# Altium schematic sheet ASCII_12_USB3_0_device.SchDoc: USB3.0 device
size A3; Organization: Lime Microsystems; Address1: Surrey Tech Centre; Address2: Guildford GU2 7YG; Address3: Surray; Address4: United Kingdom; Revision: v1.4s; SheetNumber: 12; SheetTotal: 15
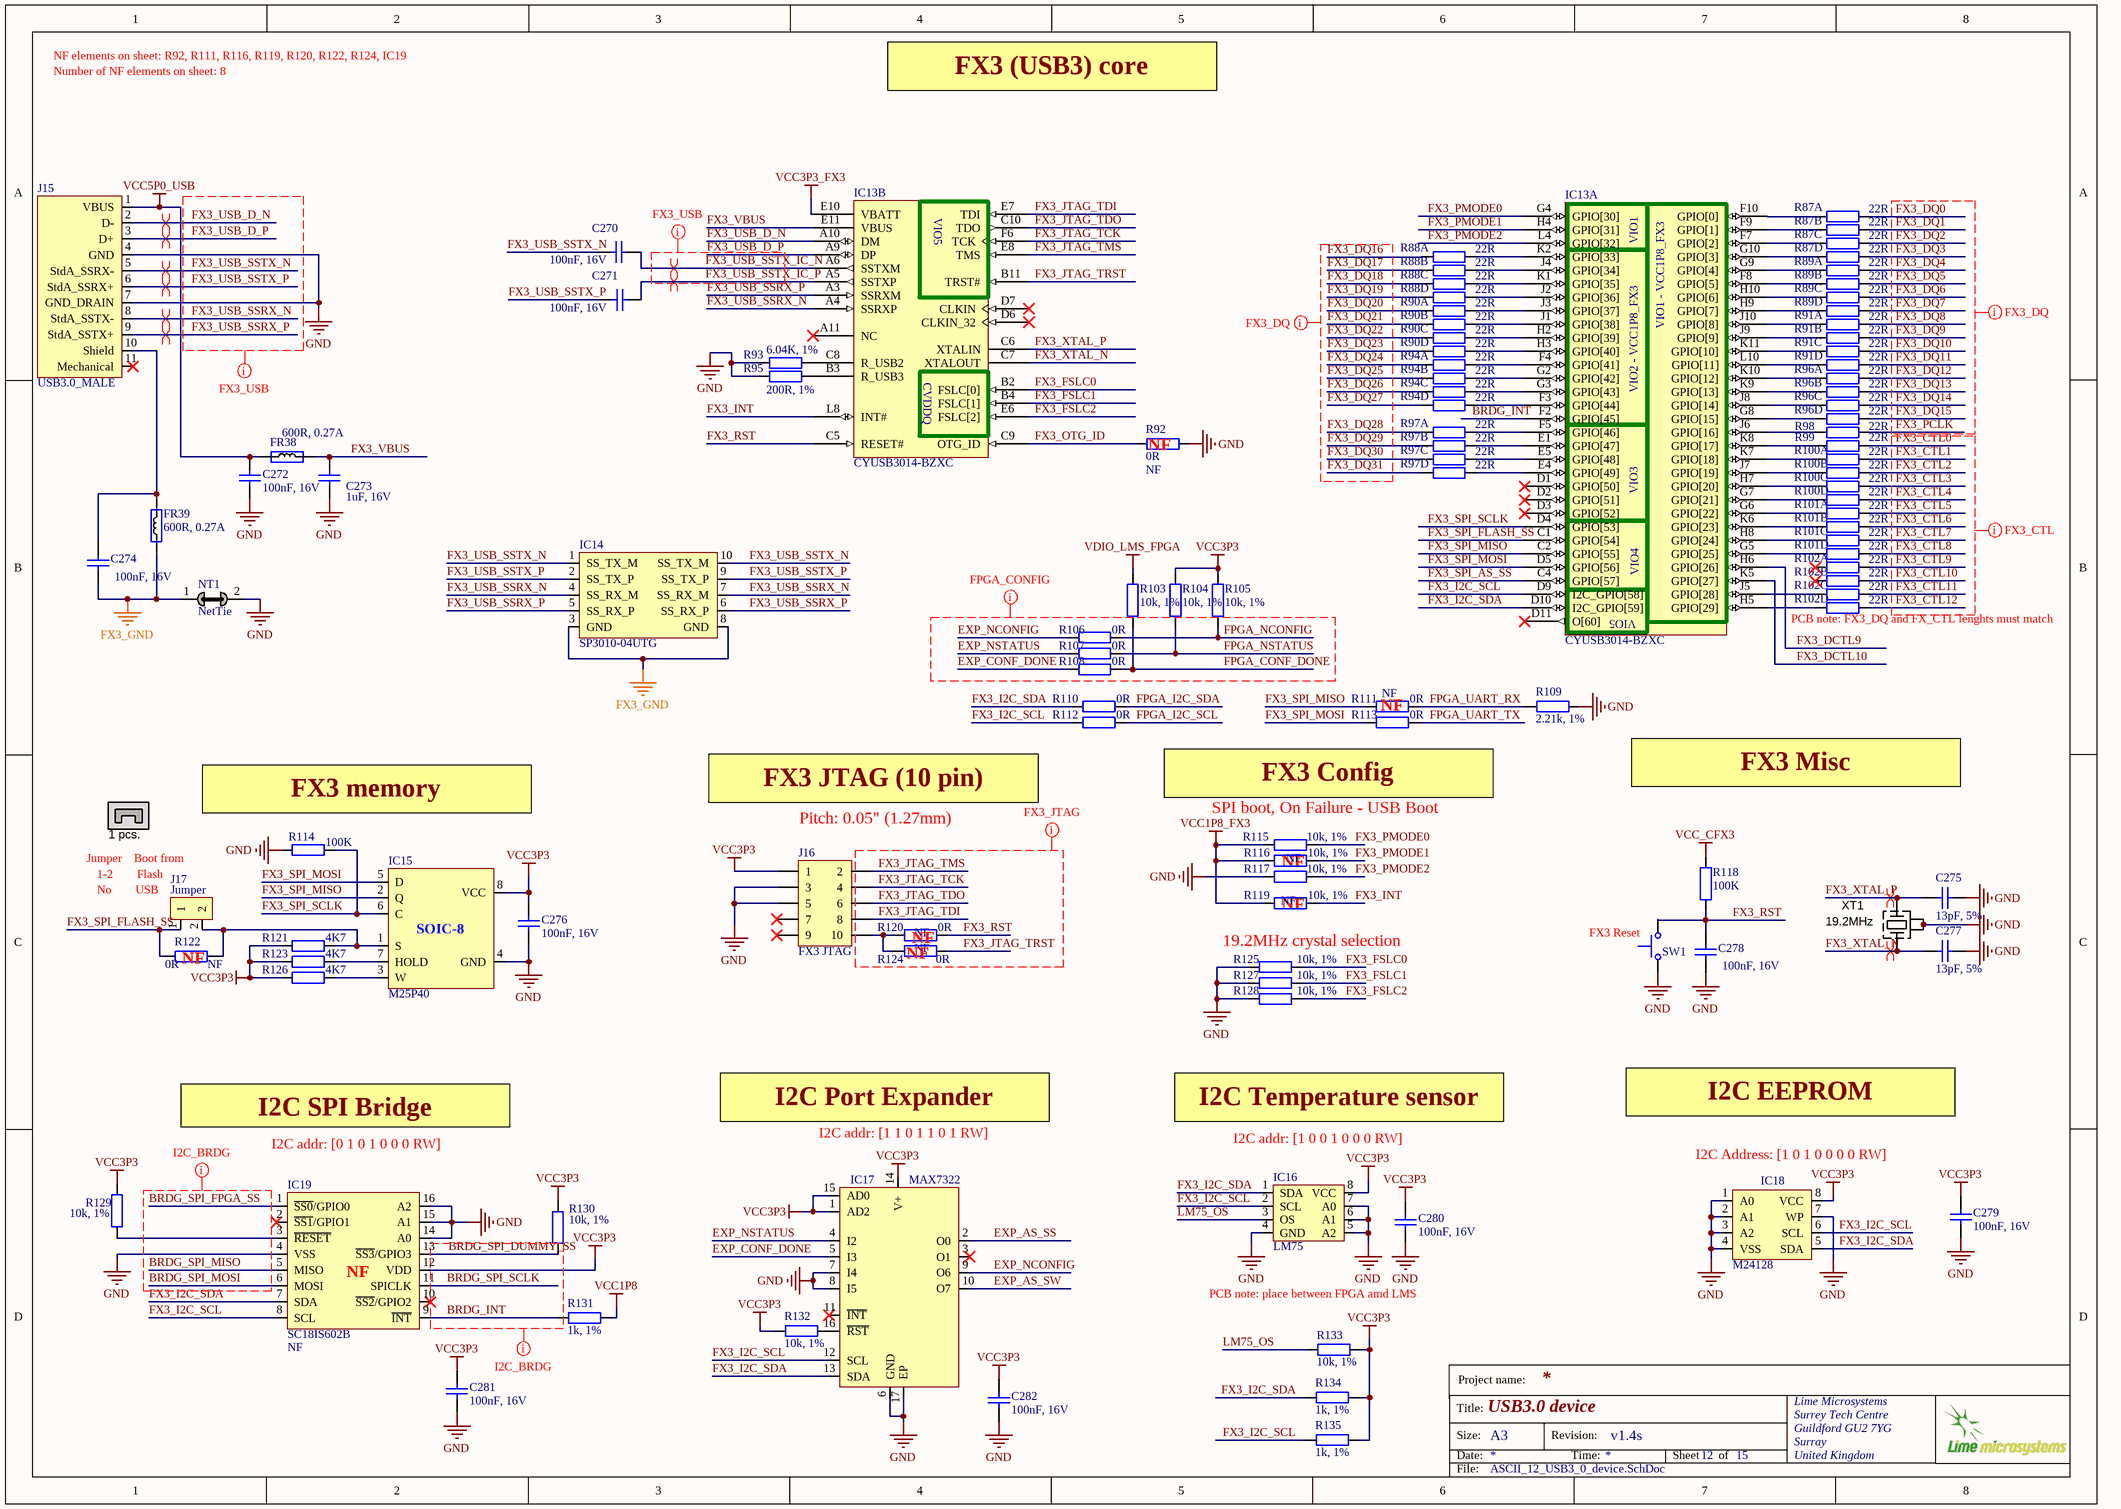
[diagram p0: ASCII_12_USB3_0_device.SchDoc]

## Parts
C270  100nF, 16V  [CAP0402]
C271  100nF, 16V  [CAP0402]
C272  100nF, 16V  [CAP0402]
C273  1uF, 16V  [CAP0603]
C274  100nF, 16V  [CAP0402]
C275  13pF, 5%  [CAP0402]
C276  100nF, 16V  [CAP0402]
C277  13pF, 5%  [CAP0402]
C278  100nF, 16V  [CAP0402]
C279  100nF, 16V  [CAP0402]
C280  100nF, 16V  [CAP0402]
C281  100nF, 16V  [CAP0402]
C282  100nF, 16V  [CAP0402]
FR38  600R, 0.27A  [RES0201]
FR39  600R, 0.27A  [RES0201]
IC13  CYUSB3014-BZXC  [CYP-BZX121]  (parts A,B of 3)
IC14  SP3010-04UTG  [SP3010-04UTG]
IC15  M25P40  [M25P40-VMN6TPB_SO8N]
IC16  LM75  [HWSON8_LM75]
IC17  MAX7322  [MAX7322ATE_QFN16]
IC18  M24128  [24FC512]
IC19  SC18IS602B  Assembly Info: NF  [SC18IS602B_TSSOP16]
J15  USB3.0_MALE  [USB3A_SM]
J16  FX3 JTAG  [SWD_10_pin]
J17  Jumper  [HDR_1x2_HALF_PITCH]
JMP1  1 pcs.  [MECH_JUMPER_HALF_PITCH]
NT1  NetTie  [NetTie_Wide2]  (net tie, no BOM)
R87  22R  [ChipResistorArray]  (parts A,B,C,D of 4)
R88  22R  [ChipResistorArray]  (parts A,B,C,D of 4)
R89  22R  [ChipResistorArray]  (parts A,B,C,D of 4)
R90  22R  [ChipResistorArray]  (parts A,B,C,D of 4)
R91  22R  [ChipResistorArray]  (parts A,B,C,D of 4)
R92  0R  Assembly Info: NF  [RES0402]
R93  6.04K, 1%  [RES0402]
R94  22R  [ChipResistorArray]  (parts A,B,C,D of 4)
R95  200R, 1%  [RES0402]
R96  22R  [ChipResistorArray]  (parts A,B,C,D of 4)
R97  22R  [ChipResistorArray]  (parts A,B,C,D of 4)
R98  22R  [RES0402]
R99  22R  [RES0402]
R100  22R  [ChipResistorArray]  (parts A,B,C,D of 4)
R101  22R  [ChipResistorArray]  (parts A,B,C,D of 4)
R102  22R  [ChipResistorArray]  (parts A,B,C,D of 4)
R103  10k, 1%  [RES0402]
R104  10k, 1%  [RES0402]
R105  10k, 1%  [RES0402]
R106  0R  [RES0402]
R107  0R  [RES0402]
R108  0R  [RES0402]
R109  2.21k, 1%  [RES0402]
R110  0R  [RES0402]
R111  0R  Assembly Info: NF  [RES0402]
R112  0R  [RES0402]
R113  0R  [RES0402]
R114  100K  [RES0402]
R115  10k, 1%  [RES0402]
R116  10k, 1%  Assembly Info: NF  [RES0402]
R117  10k, 1%  [RES0402]
R118  100K  [RES0402]
R119  10k, 1%  Assembly Info: NF  [RES0402]
R120  0R  Assembly Info: NF  [RES0402]
R121  4K7  [RES0402]
R122  0R  Assembly Info: NF  [RES0402]
R123  4K7  [RES0402]
R124  0R  Assembly Info: NF  [RES0402]
R125  10k, 1%  [RES0402]
R126  4K7  [RES0402]
R127  10k, 1%  [RES0402]
R128  10k, 1%  [RES0402]
R129  10k, 1%  [RES0402]
R130  10k, 1%  [RES0402]
R131  1k, 1%  [RES0402]
R132  10k, 1%  [RES0402]
R133  10k, 1%  [RES0402]
R134  1k, 1%  [RES0402]
R135  1k, 1%  [RES0402]
SW1  Switch, tactile  [SW_tactile]  (value not drawn)
XT1  19.2MHz  [CRYSTAL_4-LCC_v2]

## Nets
FX3_GND: C274.2 FR39.1 IC14.3(GND) IC14.8(GND) NT1.1
GND: C272.2 C273.1 C275.1 C276.2 C277.1 C278.2 C279.2 C280.2 C281.2 C282.2 IC15.4(GND) IC16.4(GND) IC16.5(A2) IC16.6(A1) IC16.7(A0) IC17.6(GND) IC17.7(I4) IC17.8(I5) IC17.17(EP) IC18.1(A0) IC18.2(A1) IC18.3(A2) IC18.4(VSS) IC18.7(WP) IC19.4(VSS) IC19.14(A0) IC19.15(A1) IC19.16(A2) J15.4(GND) J15.7(GND_DRAIN) J16.3 J16.5 NT1.2 R92.1 R93.1 R95.1 R109.1 R114.1 R117.1 R125.1 R127.1 R128.1 SW1.1 XT1.2(GND) XT1.4(GND)
VCC1P8: R131.2
VCC1P8_FX3: R115.1 R116.1 R119.1
VCC3P3: C276.1 C279.1 C280.1 C281.1 C282.1 IC15.8(VCC) IC16.8(VCC) IC17.1(AD2) IC17.14(V+) IC17.15(AD0) IC18.8(VCC) IC19.12(VDD) J16.1 R104.1 R105.1 R121.1 R123.1 R126.1 R129.1 R130.2 R132.1 R133.2 R134.1 R135.1
VCC3P3_FX3: IC13.E10(VBATT)
VCC5P0_USB: C272.1 FR38.1 J15.1(VBUS)
VCC_CFX3: R118.2
VDIO_LMS_FPGA: R103.1
BRDG_INT: IC13.F2(GPIO[45]) IC19.9(~{INT}) R131.1
BRDG_SPI_DUMMY_SS: IC19.13(~{SS3}/GPIO3) R130.1
BRDG_SPI_FPGA_SS: IC19.1(~{SS0}/GPIO0)
BRDG_SPI_MISO: IC19.5(MISO)
BRDG_SPI_MOSI: IC19.6(MOSI)
BRDG_SPI_SCLK: IC19.11(SPICLK)
EXP_AS_SS: IC17.2(O0)
EXP_AS_SW: IC17.10(O7)
EXP_CONF_DONE: IC17.5(I3) R108.1
EXP_NCONFIG: IC17.9(O6) R106.1
EXP_NSTATUS: IC17.4(I2) R107.1
FPGA_CONF_DONE: R103.2 R108.2
FPGA_I2C_SCL: R112.2
FPGA_I2C_SDA: R110.2
FPGA_NCONFIG: R105.2 R106.2
FPGA_NSTATUS: R104.2 R107.2
FPGA_UART_RX: R109.2 R111.2
FPGA_UART_TX: R113.2
FX3_CTL0: R99.2
FX3_CTL1: R100.2
FX3_CTL2: R100.4
FX3_CTL3: R100.6
FX3_CTL4: R100.8
FX3_CTL5: R101.2
FX3_CTL6: R101.4
FX3_CTL7: R101.6
FX3_CTL8: R101.8
FX3_CTL9: R102.2
FX3_CTL10: R102.4
FX3_CTL11: R102.6
FX3_CTL12: R102.8
FX3_DCTL9: IC13.H6(GPIO[26])
FX3_DCTL10: IC13.K5(GPIO[27])
FX3_DQ0: R87.2
FX3_DQ1: R87.4
FX3_DQ2: R87.6
FX3_DQ3: R87.8
FX3_DQ4: R89.2
FX3_DQ5: R89.4
FX3_DQ6: R89.6
FX3_DQ7: R89.8
FX3_DQ8: R91.2
FX3_DQ9: R91.4
FX3_DQ10: R91.6
FX3_DQ11: R91.8
FX3_DQ12: R96.2
FX3_DQ13: R96.4
FX3_DQ14: R96.6
FX3_DQ15: R96.8
FX3_DQ16: R88.1
FX3_DQ17: R88.3
FX3_DQ18: R88.5
FX3_DQ19: R88.7
FX3_DQ20: R90.1
FX3_DQ21: R90.3
FX3_DQ22: R90.5
FX3_DQ23: R90.7
FX3_DQ24: R94.1
FX3_DQ25: R94.3
FX3_DQ26: R94.5
FX3_DQ27: R94.7
FX3_DQ28: R97.1
FX3_DQ29: R97.3
FX3_DQ30: R97.5
FX3_DQ31: R97.7
FX3_FSLC0: IC13.B2(FSLC[0]) R125.2
FX3_FSLC1: IC13.B4(FSLC[1]) R127.2
FX3_FSLC2: IC13.E6(FSLC[2]) R128.2
FX3_I2C_SCL: IC13.D9(I2C_GPIO[58]) IC16.2(SCL) IC17.12(SCL) IC18.6(SCL) IC19.8(SCL) R112.1 R135.2
FX3_I2C_SDA: IC13.D10(I2C_GPIO[59]) IC16.1(SDA) IC17.13(SDA) IC18.5(SDA) IC19.7(SDA) R110.1 R134.2
FX3_INT: IC13.L8(INT#) R119.2
FX3_JTAG_TCK: IC13.F6(TCK) J16.4
FX3_JTAG_TDI: IC13.E7(TDI) J16.8
FX3_JTAG_TDO: IC13.C10(TDO) J16.6
FX3_JTAG_TMS: IC13.E8(TMS) J16.2
FX3_JTAG_TRST: IC13.B11(TRST#) R124.1
FX3_OTG_ID: IC13.C9(OTG_ID) R92.2
FX3_PCLK: R98.1
FX3_PMODE0: IC13.G4(GPIO[30]) R115.2
FX3_PMODE1: IC13.H4(GPIO[31]) R116.2
FX3_PMODE2: IC13.L4(GPIO[32]) R117.2
FX3_RST: C278.1 IC13.C5(RESET#) R118.1 R120.2 SW1.2
FX3_SPI_AS_SS: IC13.C4(GPIO[57])
FX3_SPI_FLASH_SS: IC13.C1(GPIO[54]) J17.1 R122.1
FX3_SPI_MISO: IC13.C2(GPIO[55]) IC15.2(Q) R111.1
FX3_SPI_MOSI: IC13.D5(GPIO[56]) IC15.5(D) R113.1
FX3_SPI_SCLK: IC13.D4(GPIO[53]) IC15.6(C) R114.2
FX3_USB_D_N: IC13.A10(DM) J15.2(D-)
FX3_USB_D_P: IC13.A9(DP) J15.3(D+)
FX3_USB_SSRX_N: IC13.A4(SSRXP) IC14.4(SS_RX_M) IC14.7(SS_RX_M) J15.8(StdA_SSTX-)
FX3_USB_SSRX_P: IC13.A3(SSRXM) IC14.5(SS_RX_P) IC14.6(SS_RX_P) J15.9(StdA_SSTX+)
FX3_USB_SSTX_IC_N: C270.2 IC13.A6(SSTXM)
FX3_USB_SSTX_IC_P: C271.1 IC13.A5(SSTXP)
FX3_USB_SSTX_N: C270.1 IC14.1(SS_TX_M) IC14.10(SS_TX_M) J15.5(StdA_SSRX-)
FX3_USB_SSTX_P: C271.2 IC14.2(SS_TX_P) IC14.9(SS_TX_P) J15.6(StdA_SSRX+)
FX3_VBUS: C273.2 FR38.2 IC13.E11(VBUS)
FX3_XTAL_N: C277.2 IC13.C7(XTALOUT) XT1.3(X)
FX3_XTAL_P: C275.2 IC13.C6(XTALIN) XT1.1(X)
LM75_OS: IC16.3(OS) R133.1
NetC274_1: C274.1 FR39.2 J15.10(Shield)
NetIC13_B3: IC13.B3(R_USB3) R95.2
NetIC13_C8: IC13.C8(R_USB2) R93.2
NetIC13_E1: IC13.E1(GPIO[47]) R97.4
NetIC13_E4: IC13.E4(GPIO[49]) R97.8
NetIC13_E5: IC13.E5(GPIO[48]) R97.6
NetIC13_F3: IC13.F3(GPIO[44]) R94.8
NetIC13_F4: IC13.F4(GPIO[41]) R94.2
NetIC13_F5: IC13.F5(GPIO[46]) R97.2
NetIC13_F7: IC13.F7(GPIO[2]) R87.5
NetIC13_F8: IC13.F8(GPIO[5]) R89.3
NetIC13_F9: IC13.F9(GPIO[1]) R87.3
NetIC13_F10: IC13.F10(GPIO[0]) R87.1
NetIC13_G2: IC13.G2(GPIO[42]) R94.4
NetIC13_G3: IC13.G3(GPIO[43]) R94.6
NetIC13_G5: IC13.G5(GPIO[25]) R101.7
NetIC13_G6: IC13.G6(GPIO[22]) R101.1
NetIC13_G7: IC13.G7(GPIO[21]) R100.7
NetIC13_G8: IC13.G8(GPIO[15]) R96.7
NetIC13_G9: IC13.G9(GPIO[4]) R89.1
NetIC13_G10: IC13.G10(GPIO[3]) R87.7
NetIC13_H2: IC13.H2(GPIO[39]) R90.6
NetIC13_H3: IC13.H3(GPIO[40]) R90.8
NetIC13_H5: IC13.H5(GPIO[29]) R102.7
NetIC13_H7: IC13.H7(GPIO[20]) R100.5
NetIC13_H8: IC13.H8(GPIO[24]) R101.5
NetIC13_H9: IC13.H9(GPIO[7]) R89.7
NetIC13_H10: IC13.H10(GPIO[6]) R89.5
NetIC13_J1: IC13.J1(GPIO[38]) R90.4
NetIC13_J2: IC13.J2(GPIO[36]) R88.8
NetIC13_J3: IC13.J3(GPIO[37]) R90.2
NetIC13_J4: IC13.J4(GPIO[34]) R88.4
NetIC13_J5: IC13.J5(GPIO[28]) R102.5
NetIC13_J6: IC13.J6(GPIO[16]) R98.2
NetIC13_J7: IC13.J7(GPIO[19]) R100.3
NetIC13_J8: IC13.J8(GPIO[14]) R96.5
NetIC13_J9: IC13.J9(GPIO[9]) R91.3
NetIC13_J10: IC13.J10(GPIO[8]) R91.1
NetIC13_K1: IC13.K1(GPIO[35]) R88.6
NetIC13_K2: IC13.K2(GPIO[33]) R88.2
NetIC13_K6: IC13.K6(GPIO[23]) R101.3
NetIC13_K7: IC13.K7(GPIO[18]) R100.1
NetIC13_K8: IC13.K8(GPIO[17]) R99.1
NetIC13_K9: IC13.K9(GPIO[13]) R96.3
NetIC13_K10: IC13.K10(GPIO[12]) R96.1
NetIC13_K11: IC13.K11(GPIO[10]) R91.5
NetIC13_L10: IC13.L10(GPIO[11]) R91.7
NetIC15_1: IC15.1(S) J17.2 R121.2 R122.2
NetIC15_3: IC15.3(W) R126.2
NetIC15_7: IC15.7(HOLD) R123.2
NetIC17_16: IC17.16(~{RST}) R132.2
NetIC19_3: IC19.3(~{RES}~{ET}) R129.2
NetJ16_10: J16.10 R120.1 R124.2

Not connected (* = marked no-connect by the designer): IC13 A11(NC)* D1(GPIO[50])* D2(GPIO[51])* D3(GPIO[52])* D6(CLKIN_32)* D7(CLKIN)* D11(O[60])*; IC17 3(O1)* 11(~{INT})*; IC19 2(~{SS1}/GPIO1)* 10(~{SS2}/GPIO2)*; J15 11(Mechanical)*; J16 7* 9*; JMP1 1 2; R102 1* 3*

## Layout directives
differential pair: FX3_USB_D_N, FX3_USB_D_P, FX3_USB_SSRX_N, FX3_USB_SSRX_P, FX3_USB_SSTX_IC_N, FX3_USB_SSTX_IC_P, FX3_USB_SSTX_N, FX3_USB_SSTX_P, FX3_XTAL_N, FX3_XTAL_P
net class FX3_DATA: FX3_USB_D_N, FX3_USB_D_P, FX3_USB_SSRX_N, FX3_USB_SSRX_P, FX3_USB_SSTX_IC_N, FX3_USB_SSTX_IC_P, FX3_USB_SSTX_N, FX3_USB_SSTX_P
net class FX3_CTL: FX3_CTL0, FX3_CTL1, FX3_CTL2, FX3_CTL3, FX3_CTL4, FX3_CTL5, FX3_CTL6, FX3_CTL7, FX3_CTL8, FX3_CTL9, FX3_CTL10, FX3_CTL11, FX3_CTL12
net class FX3_DQ: FX3_DQ0, FX3_DQ1, FX3_DQ2, FX3_DQ3, FX3_DQ4, FX3_DQ5, FX3_DQ6, FX3_DQ7, FX3_DQ8, FX3_DQ9, FX3_DQ10, FX3_DQ11, FX3_DQ12, FX3_DQ13, FX3_DQ14, FX3_DQ15, FX3_DQ16, FX3_DQ17, FX3_DQ18, FX3_DQ19, FX3_DQ20, FX3_DQ21, FX3_DQ22, FX3_DQ23, FX3_DQ24, FX3_DQ25, FX3_DQ26, FX3_DQ27, FX3_DQ28, FX3_DQ29, FX3_DQ30, FX3_DQ31, FX3_PCLK
net class I2C_BRDG: BRDG_INT, BRDG_SPI_DUMMY_SS, BRDG_SPI_FPGA_SS, BRDG_SPI_MISO, BRDG_SPI_MOSI, BRDG_SPI_SCLK
net class FX3_JTAG: FX3_JTAG_TCK, FX3_JTAG_TDI, FX3_JTAG_TDO, FX3_JTAG_TMS, FX3_JTAG_TRST, FX3_RST
net class FPGA_CONFIG: EXP_CONF_DONE, EXP_NCONFIG, EXP_NSTATUS, FPGA_CONF_DONE, FPGA_NCONFIG, FPGA_NSTATUS

## Notes on the sheet
- NF elements on sheet: R92, R111, R116, R119, R120, R122, R124, IC19
- Number of NF elements on sheet: 8
- FX3 (USB3) core
- (near IC13) VIO5
- (near IC13) VIO1
- (near IC13) CVDDQ
- (near IC13) VIO1 - VCC1P8_FX3
- (near R92) NF
- (near IC13) VIO2 - VCC1P8_FX3
- (near IC13) VIO3
- (near IC13) VIO4
- (near R102) PCB note: FX3_DQ and FX_CTL lenghts must match
- (near R111) NF
- FX3 Misc
- FX3 memory
- FX3 JTAG (10 pin)
- (near J16) Pitch: 0.05" (1.27mm)
- FX3 Config
- SPI boot, On Failure - USB Boot
- Jumper    Boot from
- (near J17) 1-2        Flash
- (near J17) No        USB
- (near R119) NF
- (near R116) NF
- (near R122) NF
- (near R124) NF
- NF
- (near R125) 19.2MHz crystal selection
- (near SW1) FX3 Reset
- I2C SPI Bridge
- I2C Port Expander
- I2C Temperature sensor
- I2C EEPROM
- (near IC19) I2C addr: [0 1 0 1 0 0 0 RW]
- (near IC17) I2C addr: [1 1 0 1 1 0 1 RW]
- I2C addr: [1 0 0 1 0 0 0 RW]
- (near IC18) I2C Address: [1 0 1 0 0 0 0 RW]
- (near IC19) NF
- PCB note: place between FPGA amd LMS
- Project name:
- Title:
- Size:
- Date:
- A3
- Revision:
- Time:
- Sheet
- of
- File:
- (in symbol M25P40) SOIC-8

## Library data of the parts
C270 C271 C274 C276 C278-C282 = Cap_0603: Manufacturer Part Number 1: GRM155R71C104KA88D; Part Description: 0.10µF ±10% 16V X7R Ceramic Capacitor -55°C ~ 125°C Surface Mount, MLCC 0402 (1005 Metric) 0.039" L x 0.020" W (1.00mm x 0.50mm); Brand: Murata Electronics; Tolerance: 10 %; Type: General Purpose MLCC; Capacitance: 0.1 uF; Temperature Coefficient / Code: +/- 15 %; Supplier 1: Mouser; Supplier Part Number 1: 81-GRM155R71C104KA88; Case Code - in: 0402; Manufacturer: Murata Electronics; Category: Multilayer Ceramic Capacitors MLCC - SMD/SMT; Voltage Rating DC: 16 V; Value: 100nF, 16V; Manufacturer Part Number: GRM155R71C104KA88D
C272 = Cap_0402: Manufacturer: Murata Electronics; Manufacturer Part Number: GRM155R71C104KA88D; Part Description: 0.10µF ±10% 16V X7R Ceramic Capacitor -55°C ~ 125°C Surface Mount, MLCC 0402 (1005 Metric) 0.039" L x 0.020" W (1.00mm x 0.50mm); Tolerance: 10 %; Type: General Purpose MLCC; Capacitance: 0.1 uF; Case Length: 1 mm; Dielectric: X7R; Case Height: 0.5 mm; Temperature Coefficient / Code: +/- 15 %; Value: 100nF, 16V; Supplier 1: Mouser; Supplier Part Number 1: 81-GRM155R71C104KA88; Case Code - in: 0402; RoHS: RoHS Compliant; Operating Temperature Range: - 55 C to + 125 C; Series: GRM; Termination Style: SMD/SMT; Package / Case: 0402 (1005 metric); Voltage Rating DC: 16 V; Maximum Operating Temperature: + 125 C; Case Code - mm: 1005; Minimum Operating Temperature: - 55 C; Product Category: Low & Medium Capacitance SMD Ceramic Chip Capacitors; Packaging: Reel; Product: General Type MLCCs; Category: Multilayer Ceramic Capacitors MLCC - SMD/SMT; Brand: Murata Electronics; Case Width: 0.5 mm; RoHS - Mouser: Y; Standard Pack Qty: 10000; Minimum Order Quantity: 1; Reeling: True; Manufacturer Part Number 1: GRM155R71C104KA88D
C273 = Cap_0603: Part Description: 1µF ±10% 16V X7R Ceramic Capacitor -55°C ~ 125°C Surface Mount, MLCC 0603 (1608 Metric) 0.063" L x 0.031" W (1.60mm x 0.80mm); Manufacturer Part Number 1: EMK107B7105KA-T; Manufacturer: Taiyo Yuden; Temperature Coefficient: X7R; Capacitance: 1µF; Tolerance: ±10%; Value: 1uF, 16V; Supplier 1: Digi-Key; Supplier Part Number 1: 587-1241-6-ND; Package / Case: 0603 (1608 Metric); Mounting Type: Surface Mount, MLCC; Lead Style: -; Features: -; Voltage - Rated: 16V; Size / Dimension: 0.063" L x 0.031" W (1.60mm x 0.80mm); Height - Seated (Max): -; Packaging: Digi-Reel®; Thickness (Max): 0.035" (0.90mm); Lead Spacing: -; Ratings: -; RoHS: RoHS Compliant; Operating Temperature: -55°C ~ 125°C; Category: Capacitors; Applications: General Purpose
C275 C277 = Cap_0603: Manufacturer: Murata Electronics North America; Part Description: 13pF ±5% 50V C0G, NP0 Ceramic Capacitor -55°C ~ 125°C Surface Mount, MLCC 0402 (1005 Metric) 0.039" L x 0.020" W (1.00mm x 0.50mm); Voltage - Rated: 50V; Supplier 1: Digi-Key; Supplier Part Number 1: 490-5925-2-ND; Tolerance: ±5%; Capacitance: 13pF; Category: Capacitors; Package / Case: 0402 (1005 Metric); Value: 13pF, 5%
FR38 FR39 = Ferrite: Manufacturer Part Number 1: BK0603TS601-T; Manufacturer: Taiyo Yuden; Part Description: FERRITE BEAD 600 OHM 0201 1LN; DC Resistance (DCR): 750 mOhm Max; Filter Type: Differential Mode - Single; Impedance @ Frequency: 600 Ohm @ 100MHz; Current Rating: 270mA; Supplier 1: Digi-Key; Supplier Part Number 1: 587-3277-1-ND; Size / Dimension: 0.024" L x 0.012" W (0.60mm x 0.30mm); Package / Case: 0201 (0603 Metric); Height (Max): 0.013" (0.33mm); Mounting Type: Surface Mount; Packaging: Cut Tape (CT); RoHS: RoHS Compliant; Category: Filters; Value: 600R, 0.27A
IC13 = CYUSB3014-BZXC: EZ-USB(R) FX3: SuperSpeed USB Controller, 512 KB, 60 I/Os, 0 to 70 degC, 121-Pin FBGA (BZX121); Manufacturer: Cypress Semiconductor Corp; CPU Core: ARM926 EJ-S; Max. Operating Voltage (V): 1.25; Memory Architecture: SRAM; Memory Size (KB): 512; Min. Operating Voltage (V): 1.15; No. of I/Os: 60; DatasheetVersion: Rev. *O; PackageVersion: Rev. *D; PackageReference: BZX121; PackageDescription: 121-Ball FBGA, Body 10 x 10 mm, Pitch 0.8 mm; Supplier 1: Digi-Key; Supplier Part Number 1: 428-3182-ND; Supplier 2: Farnell; Supplier Part Number 2: 2355789; Supplier 3: Newark; Supplier Part Number 3: 54W7901; Supplier 4: Mouser; Supplier Part Number 4: 727-CYUSB3014-BZXC; Max. Operating Temp. (degreesC): 70; Min. Operating Temp. (degreesC): 0; RoHS: Pb-Free; Mounting Technology: Surface Mount; Code_JEDEC: PUB 95; PartNumber: CYUSB3014-BZXC; ComponentLink1Description: Manufacturer URL; ComponentLink1URL: http://www.cypress.com/; ComponentLink2Description: Datasheet; ComponentLink2URL: http://www.cypress.com/?docID=49087; ComponentLink3Description: Package Specification; ComponentLink3URL: http://www.cypress.com/?docID=45795; Part Description: EZ-USB(R) FX3: SuperSpeed USB Controller, 512 KB, 60 I/Os, 0 to 70 degC, 121-Pin FBGA (BZX121)
IC14 = SP3010-04UTG: Manufacturer: Littelfuse Inc; Part Description: TVS DIODE 6VWM 12.3VC UDFN; Supplier 1: Digi-Key; Category: Circuit Protection; Supplier Device Package: 10-µDFN (2.5x1.0); Supplier Part Number 1: F3507TR-ND; Manufacturer Part Number 1: SP3010-04UTG
IC15 = M25P40: Manufacturer: Micron Technology Inc; Part Description: IC FLASH 4MBIT 75MHZ 8SO; Manufacturer Part Number 1: M25P40-VMN6TPB; Memory Size: 4M (512K x 8); Voltage - Supply: 2.3 V ~ 3.6 V; Supplier 1: Digi-Key; Supplier Device Package: 8-SO; Supplier Part Number 1: M25P40-VMN6TPBTR-ND
IC16 = LM75: Manufacturer: NXP Semiconductors; Manufacturer Part Number: LM75BTP,147; Part Description: SENSOR TEMPERATURE I2C 8HWSON; Sensing Temperature - Local: -55°C ~ 125°C; Output Type: I²C; Accuracy - Highest (Lowest): ±2°C (±3°C); Voltage - Supply: 2.8 V ~ 5.5 V; Test Condition: -25°C ~ 100°C (-55°C ~ 125°C); Sensor Type: Digital, Local; Resolution: 10 b; Supplier 1: Digi-Key; Operating Temperature: -55°C ~ 125°C; Features: Output Switch, Programmable Limit, Shutdown Mode; Supplier Device Package: 8-HWSON (2x3); Sensing Temperature - Remote: -; Category: Sensors, Transducers; Packaging: Tape & Reel (TR); RoHS: RoHS Compliant; Package / Case: 8-WFDFN Exposed Pad; Supplier Part Number 1: 568-9815-2-ND
IC17 = MAX7322ATE+: Manufacturer: Maxim Integrated; Part Description: IC I/O EXPANDER I2C 4B 16TQFN; Interface: I²C; Number of I/O: 4 (Input Only); Voltage - Supply: 1.7 V ~ 5.5 V; Interrupt Output: Yes; Current - Output Source/Sink: 20mA; Frequency - Clock: 400kHz; Supplier 1: Digi-Key; Mounting Type: Surface Mount; Category: Integrated Circuits (ICs); RoHS: RoHS Compliant; Packaging: Tube; Manufacturer Part Number: MAX7322ATE+; Supplier Device Package: 16-TQFN-EP (3x3); Package / Case: 16-WFQFN Exposed Pad; Operating Temperature: -40°C ~ 125°C; Features: POR; Output Type: -; Supplier Part Number 1: MAX7322ATE+-ND
IC18 = 24FC64F: Part Description: IC EEPROM 128KBIT 1MHZ 8TSSOP; Manufacturer: STMicroelectronics; Manufacturer Part Number 1: M24128-DRDW8TP/K; Format - Memory: EEPROMs - Serial; Memory Type: EEPROM; Memory Size: 128K (16K x 8); Speed: 1MHz; Interface: I²C, 2-Wire Serial; Voltage - Supply: 1.8 V ~ 5.5 V; Supplier 1: Digi-Key; Supplier Part Number 1: 497-15336-1-ND; RoHS: RoHS Compliant; Category: Integrated Circuits (ICs); Stock 1: 1677; Pricing 1: 1=0.47, 10=0.464, 100=0.3805, 500=0.36996, 1000=0.36005 (USD); Packaging: Cut Tape (CT); Part Status: Active; Operating Temperature: -40°C ~ 105°C (TA); Package / Case: 8-TSSOP (0.173", 4.40mm Width); Supplier Device Package: 8-TSSOP; ComponentLink1URL: http://www.st.com/content/ccc/resource/technical/document/datasheet/5c/f3/4b/70/8e/63/48/95/DM00149696.pdf/files/DM00149696.pdf/jcr:content/translations/en.DM00149696.pdf; ComponentLink1Description: http://www.st.com/content/ccc/resource/technical/document/datasheet/5c/f3/4b/70/8e/63/48/95/DM00149696.pdf/files/DM00149696.pdf/jcr:content/translations/en.DM00149696.pdf
IC19 = SC18IS602: Manufacturer Part Number 1: SC18IS602BIPW,112; Manufacturer: NXP Semiconductors; Part Description: IC BRIDGE SPI/I2C 16-TSSOP; Interface: SPI; Voltage - Supply: 2.4 V ~ 3.6 V; Current - Supply: 11mA; Function: Controller; Protocol: I²C; Standards: -; Operating Temperature: -40°C ~ 85°C; RoHS: RoHS Compliant; Packaging: Tube; Category: Integrated Circuits (ICs); Supplier Device Package: 16-TSSOP; Package / Case: 16-TSSOP (0.173", 4.40mm Width); Supplier 1: Digi-Key; Supplier Part Number 1: 568-4785-5-ND
J15 = USB3.0_MALE: Manufacturer Part Number 1: USB1065-30-A; Manufacturer: GLOBAL CONNECTOR TECHNOLOGY; Part Description: USB - A USB 3.0, Super Speed Plug Connector 9 Position Surface Mount, Right Angle, Horizontal; Supplier 1: Farnell; Supplier Part Number 1: 2443106; RoHS: YES
J16 = Header 5X2_SWD: Header, 5-Pin, Dual row; Manufacturer Part Number 1: M50-3600542; Manufacturer: Harwin Inc; Part Description: CONN HDR 1.27MM SMD AU 10POS; Number of Positions: 10; Molding Height Above Board: 0.039" (1.00mm); Row Spacing: 0.050" (1.27mm); Number of Positions Loaded: All; Connector Type: Unshrouded; Supplier 1: Digi-Key; Contact Mating Length: 0.118" (3.00mm); Category: Connectors, Interconnects; Color: Black; RoHS: RoHS Compliant; Number of Rows: 2; Contact Finish Thickness: 3µin (0.08µm); Height Stacking (Mating): -; Contact Finish: Gold; Termination: Solder; Mounting Type: Surface Mount; Pitch: 0.050" (1.27mm); Features: -; Packaging: Bulk; Supplier Part Number 1: 952-1389-ND
J17 = Jumper: Manufacturer Part Number 1: GRPB021VWVN-RC; Manufacturer: Sullins Connector Solutions; Part Description: 2 Positions Header, Unshrouded Connector 0.050" (1.27mm) Through Hole Gold; Connector Type: Header, Unshrouded; Number of Positions: 2; Number of Positions Loaded: All; Pitch: 0.050" (1.27mm); Supplier 1: Digi-Key; Supplier Part Number 1: S9014E-02-ND; Contact Mating Length: 0.118" (3.00mm); Mounting Type: Through Hole; Termination: Solder; Fastening Type: -; Features: -; Contact Finish: Gold; Contact Finish Thickness: Flash; Color: -; Category: Connectors, Interconnects; RoHS: RoHS Compliant; Packaging: Bulk; Contact Type: Male Pin; Number of Rows: 1; Row Spacing: -
JMP1 = JUMP_2P_CONN_HEADER: Shorting Jumper, 2-position, 1.27mm pitch; Manufacturer Part Number 1: M50-2030005; Manufacturer: Harwin Inc.; Part Description: CONN SHUNT 1.27MM BLUE W/HANDLE; Gender: Female Sockets; Number of Positions or Pins (Grid): 2 (1 x 2); Pitch: 0.050" (1.27mm); Supplier 1: Digi-Key; Supplier Part Number 1: 952-1732-ND; Category: Connectors, Interconnects; RoHS: RoHS Compliant; Packaging: Bulk; Type: Closed Top, Grip; Height: 0.217" (5.50mm); Contact Finish: Gold; Contact Finish Thickness: 1µin (0.025µm); Color: Blue
R87-R91 R94 R96 R97 R100-R102 = ResArray_0802: Part Description: RES ARRAY 4 RES 22 OHM 0804; Manufacturer: Yageo; Manufacturer Part Number 1: YC124-JR-0722RL; Temperature Coefficient: ±200ppm/°C; Tolerance: ±5%; Supplier 1: Digi-Key; Supplier Part Number 1: YC124J-22TR-ND; Package / Case: 0804, Convex, Long Side Terminals; Value: 22R
R92 R106-R108 R110-R113 R120 = Res_0402: Manufacturer: Yageo; Part Description: RES SMD 0.0OHM JUMPER 1/16W 0402; Supplier 1: Digi-Key; Supplier Part Number 1: 311-0.0JRTR-ND; Composition: Thick Film; Package / Case: 0402 (1005 Metric); Category: Resistors; Value: 0R
R93 = Res_0402: Manufacturer: Rohm Semiconductor; Manufacturer Part Number 1: MCR01MRTF6041; Part Description: RES SMD 6.04K OHM 1% 1/16W 0402; Temperature Coefficient: ±100ppm/°C; Supplier Part Number 1: RHM6.04KCDTR-ND; Supplier 1: Digi-Key; Category: Resistors; Supplier Device Package: 0402 (1005 Metric); Composition: Thick Film; Tolerance: ±1%; Value: 6.04K, 1%
R95 = Res_0402: Manufacturer: Stackpole Electronics Inc; Part Description: RES SMD 200 OHM 1% 1/16W 0402; Power (Watts): 0.063W, 1/16W; Resistance (Ohms): 200; Temperature Coefficient: ±100ppm/°C; Supplier 1: Digi-Key; Supplier Device Package: 0402; Composition: Thick Film; Category: Resistors; Tolerance: ±1%; Supplier Part Number 1: RMCF0402FT200RDKR-ND; Value: 200R, 1%
R98 R99 = Res_0402: Part Description: RES SMD 22 OHM 1% 1/16W 0402; Manufacturer Part Number 1: RC0402FR-0722RL; Manufacturer: Yageo; Tolerance: ±1%; Temperature Coefficient: ±100ppm/°C; Resistance (Ohms): 22; Supplier 1: Digi-Key; Supplier Part Number 1: 311-22.0LRTR-ND; Supplier Device Package: 0402; Composition: Thick Film; Category: Resistors; Value: 22R
R103-R105 R115-R117 R119 R125 R127-R130 R132 R133 = Res_0402: Manufacturer: Yageo; Manufacturer Part Number 1: RC0402FR-0710KL; Part Description: RES SMD 10K OHM 1% 1/16W 0402; Temperature Coefficient: ±100ppm/°C; Power (Watts): 0.063W, 1/16W; Value: 10k, 1%; Supplier 1: Digi-Key; Supplier Part Number 1: 311-10.0KLRTR-ND; Resistance (Ohms): 10k; Packaging: Tape & Reel (TR); RoHS: RoHS Compliant; Package / Case: 0402 (1005 Metric); Tolerance: ±1%; Operating Temperature: -55°C ~ 155°C; Size / Dimension: 0.039" L x 0.020" W (1.00mm x 0.50mm); Number of Terminations: 2; Category: Resistors; Height: 0.016" (0.40mm); Supplier Device Package: 0402; Features: Moisture Resistant; Composition: Thick Film
R109 = Res_0402: Manufacturer: Stackpole Electronics Inc.; Manufacturer Part Number 1: RMCF0402FT2K21; Part Description: RES SMD 2.21K OHM 1% 1/16W 0402; Power (Watts): 0.063W, 1/16W; Temperature Coefficient: ±100ppm/°C; Value: 2.21k, 1%; Supplier 1: Digi-Key; Supplier Part Number 1: RMCF0402FT2K21CT-ND; Operating Temperature: -55°C ~ 155°C; Height: 0.016" (0.40mm); Tolerance: ±1%; Resistance (Ohms): 2.21k; Features: Automotive AEC-Q200; Package / Case: 0402 (1005 Metric); Packaging: Cut Tape (CT); Composition: Thick Film; Category: Resistors; Supplier Device Package: 0402; Number of Terminations: 2; RoHS: RoHS Compliant; Size / Dimension: 0.039" L x 0.020" W (1.00mm x 0.50mm)
R114 R118 = Res_0402: Manufacturer Part Number 1: ERJ-2GEJ104X; Manufacturer: Panasonic Electronic Components; Part Description: RES SMD 100K OHM 5% 1/10W 0402; Tolerance: ±5%; Temperature Coefficient: ±200ppm/°C; Power (Watts): 0.1W, 1/10W; Value: 100K; Supplier 1: Digi-Key; Supplier Part Number 1: P100KJCT-ND; Resistance (Ohms): 100k; Composition: Thick Film; Features: Automotive AEC-Q200; Number of Terminations: 2; Height: 0.016" (0.40mm); RoHS: RoHS Compliant; Package / Case: 0402 (1005 Metric); Packaging: Cut Tape (CT); Size / Dimension: 0.039" L x 0.020" W (1.00mm x 0.50mm); Supplier Device Package: 0402; Operating Temperature: -55°C ~ 155°C; Category: Resistors
R121 R123 R126 = Res_0402: Manufacturer Part Number 1: RMCF0402JT4K70; Part Description: RES SMD 4.7K OHM 5% 1/16W 0402; Manufacturer: Stackpole Electronics Inc.; Temperature Coefficient: ±100ppm/°C; Resistance(Ohms): 4.7k; Tolerance: ±5%; Supplier 1: Digi-Key; Composition: Thick Film; Supplier Device Package: 0402; Supplier: Digi-Key; Supplier Part Number 1: RMCF0402JT4K70TR-ND; Category: Resistors; Value: 4K7
R122 R124 = Res_0402: Manufacturer Part Number 1: RC0402JR-070RL; Manufacturer: Yageo; Part Description: RES SMD 0.0OHM JUMPER 1/16W 0402; Resistance (Ohms): 0.0; Tolerance: Jumper; Power (Watts): 0.063W, 1/16W; Value: 0R; Supplier 1: Digi-Key; Supplier Part Number 1: 311-0.0JRTR-ND; Category: Resistors; Temperature Coefficient: -; Features: Moisture Resistant; Supplier Device Package: 0402; Height: 0.016" (0.40mm); Package / Case: 0402 (1005 Metric); Operating Temperature: -55°C ~ 155°C; Size / Dimension: 0.039" L x 0.020" W (1.00mm x 0.50mm); Composition: Thick Film; Packaging: Tape & Reel (TR); Number of Terminations: 2; RoHS: RoHS Compliant
R131 R134 R135 = Res_0402: Manufacturer: Stackpole Electronics Inc; Manufacturer Part Number 1: RMCF0402FT1K00; Part Description: RES SMD 1K OHM 1% 1/16W 0402; Temperature Coefficient: ±100ppm/°C; Power (Watts): 0.063W, 1/16W; Value: 1k, 1%; Supplier 1: Digi-Key; Supplier Part Number 1: RMCF0402FT1K00TR-ND; Resistance (Ohms): 1k; Packaging: Tape & Reel (TR); Category: Resistors; RoHS: RoHS Compliant; Tolerance: ±1%; Height: 0.016" (0.40mm); Number of Terminations: 2; Package / Case: 0402 (1005 Metric); Operating Temperature: -55°C ~ 155°C; Composition: Thick Film; Supplier Device Package: 0402; Size / Dimension: 0.039" L x 0.020" W (1.00mm x 0.50mm)
  R131: Features: -
  R134 R135: Features: Moisture Resistant
SW1 = Button: Part Description: SWITCH TACTILE SPST-NO 0.05A 12V; Manufacturer: Omron Electronics Inc-EMC Div; Manufacturer Part Number 1: B3U-1000P; Outline: 3.00mm x 2.50mm; Actuator Type: Standard; Mechanical Life: 200,000 Cycles; Actuator Orientation: Top Actuated; Supplier 1: Digi-Key; Supplier Part Number 1: SW1020TR-ND; Category: Switches
XT1 = CRYSTAL_19M2: Oscillator Crystal 19.2 MHz; Manufacturer Part Number 1: 405C35B19M20000; Manufacturer: CTS-Frequency Controls; Part Description: 19.2MHz ±30ppm Crystal 13pF 60 Ohm -20°C ~ 70°C Surface Mount 4-SMD, No Lead (DFN, LCC); Frequency Tolerance: ±30ppm; ESR (Equivalent Series Resistance): 60 Ohm; Load Capacitance: 13pF; Frequency Stability: ±50ppm; Operating Mode: Fundamental; Supplier 1: Digi-Key; Supplier Part Number 1: CTX648CT-ND; Height: 0.041" (1.05mm); Category: Crystals and Oscillators; Package / Case: 4-SMD, No Lead (DFN, LCC); Mounting Type: Surface Mount; Operating Temperature: -20°C ~ 70°C; Size / Dimension: 0.197" L x 0.126" W (5.00mm x 3.20mm); Frequency: 19.2MHz